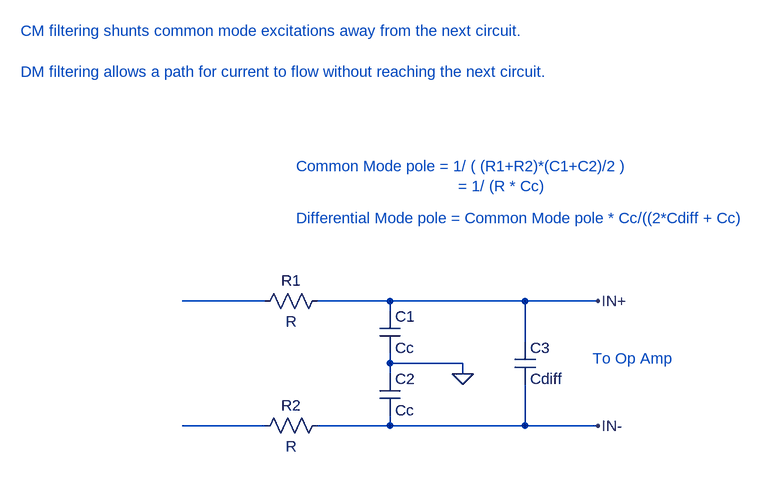
[diagram p0: schematic EMIfilterRC.asc]
EMIfilterRC.asc, the LTspice schematic file:
Version 4
SHEET 1 1016 680
WIRE 0 128 -128 128
WIRE 192 128 80 128
WIRE 400 128 192 128
WIRE 512 128 400 128
WIRE 192 144 192 128
WIRE 400 192 400 128
WIRE 192 224 192 208
WIRE 304 224 192 224
WIRE 192 240 192 224
WIRE 304 240 304 224
WIRE 0 320 -128 320
WIRE 192 320 192 304
WIRE 192 320 80 320
WIRE 400 320 400 256
WIRE 400 320 192 320
WIRE 512 320 400 320
FLAG 304 240 0
FLAG 512 128 IN+
FLAG 512 320 IN-
SYMBOL res 96 112 R90
WINDOW 0 0 56 VBottom 2
WINDOW 3 32 56 VTop 2
SYMATTR InstName R1
SYMBOL res 96 304 R90
WINDOW 0 0 56 VBottom 2
WINDOW 3 32 56 VTop 2
SYMATTR InstName R2
SYMBOL cap 176 144 R0
SYMATTR InstName C1
SYMATTR Value Cc
SYMBOL cap 176 240 R0
SYMATTR InstName C2
SYMATTR Value Cc
SYMBOL cap 384 192 R0
SYMATTR InstName C3
SYMATTR Value Cdiff
TEXT 504 216 Left 2 ;To Op Amp
TEXT 48 -80 Left 2 ;Common Mode pole = 1/ ( (R1+R2)*(C1+C2)/2 )\n                                    = 1/ (R * Cc)
TEXT 48 0 Left 2 ;Differential Mode pole = Common Mode pole * Cc/((2*Cdiff + Cc)
TEXT -376 -288 Left 2 ;CM filtering shunts common mode excitations away from the next circuit.\n \nDM filtering allows a path for current to flow without reaching the next circuit.

The netlist it stands for:
* EMIfilterRC.asc
R1 IN+ N001 R
R2 IN- N002 R
C1 IN+ 0 Cc
C2 0 IN- Cc
C3 IN+ IN- Cdiff
* To Op Amp
* Common Mode pole = 1/ ( (R1+R2)*(C1+C2)/2 )
*                                     = 1/ (R * Cc)
* Differential Mode pole = Common Mode pole * Cc/((2*Cdiff + Cc)
* CM filtering shunts common mode excitations away from the next circuit.
* DM filtering allows a path for current to flow without reaching the next circuit.
.backanno
.end